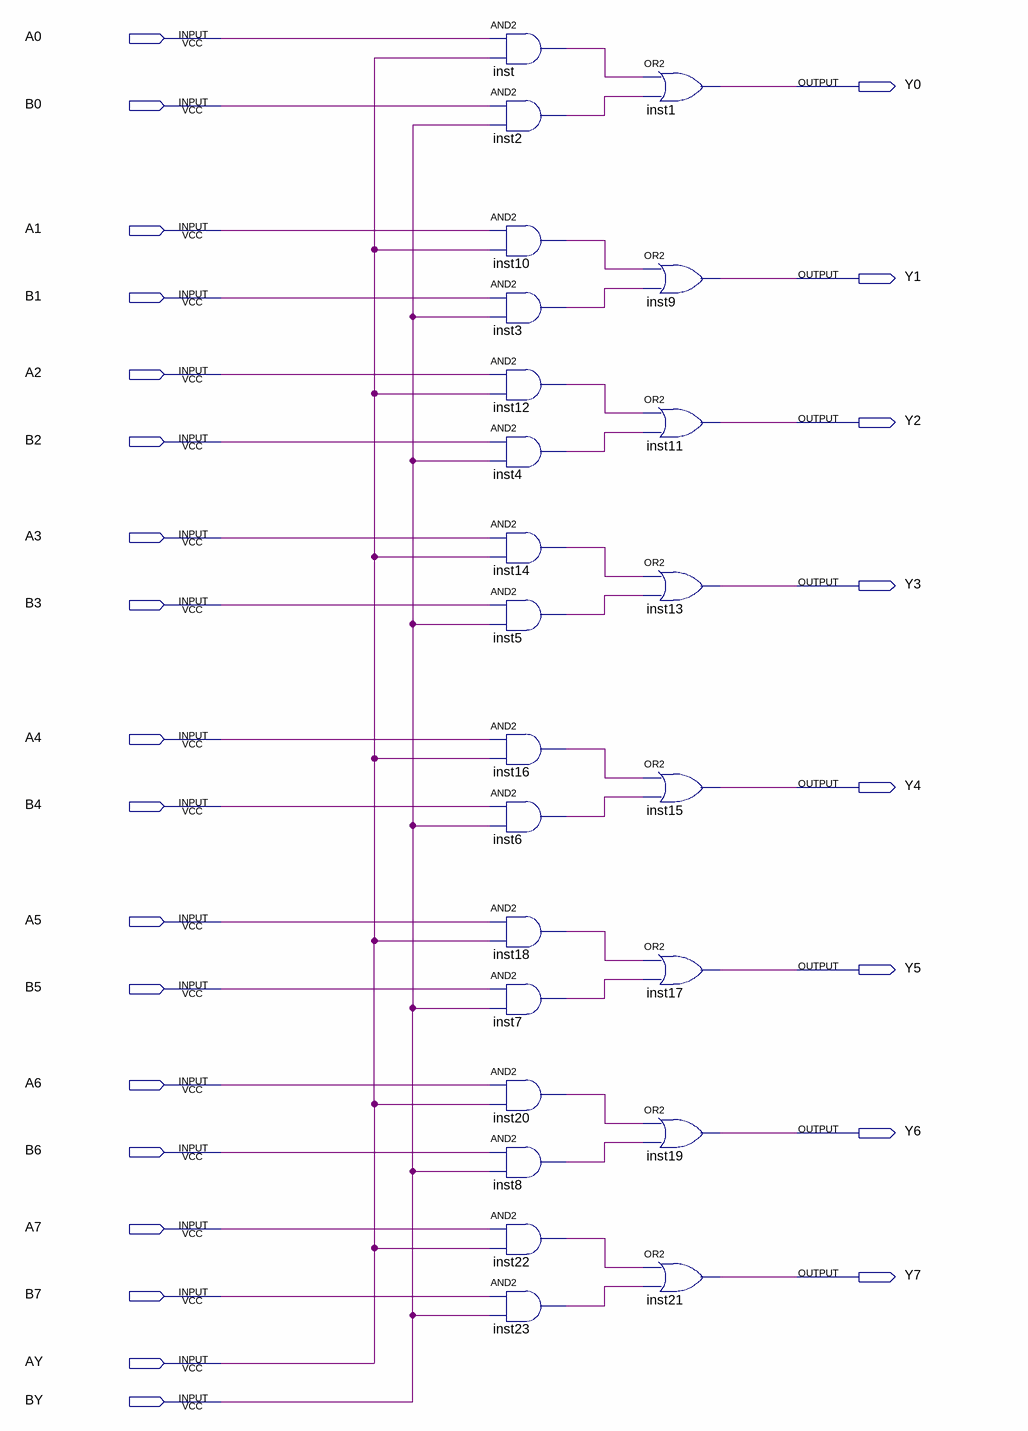
[diagram p0: schematic sheet]
// Quartus schematic multiplexer8_2.bdf as structural Verilog: 24 symbols, 26 pins
module multiplexer8_2 (
  input  A0,
  input  B0,
  input  A1,
  input  B1,
  input  A2,
  input  B2,
  input  A3,
  input  B3,
  input  A4,
  input  B4,
  input  A5,
  input  B5,
  input  A6,
  input  B6,
  input  A7,
  input  B7,
  input  AY,
  input  BY,
  output Y0,
  output Y1,
  output Y2,
  output Y3,
  output Y4,
  output Y5,
  output Y6,
  output Y7
);

  wire inst2_out, inst3_out, inst4_out, inst5_out, inst6_out, inst7_out, inst8_out, inst10_out, inst12_out,
       inst14_out, inst16_out, inst18_out, inst20_out, inst22_out, inst23_out, inst_out;

  and inst (inst_out, A0, AY);
  and inst2 (inst2_out, B0, BY);
  and inst10 (inst10_out, A1, AY);
  and inst3 (inst3_out, B1, BY);
  and inst12 (inst12_out, A2, AY);
  and inst4 (inst4_out, B2, BY);
  and inst14 (inst14_out, A3, AY);
  and inst5 (inst5_out, B3, BY);
  and inst16 (inst16_out, A4, AY);
  and inst6 (inst6_out, B4, BY);
  and inst18 (inst18_out, A5, AY);
  and inst7 (inst7_out, B5, BY);
  and inst20 (inst20_out, A6, AY);
  and inst8 (inst8_out, B6, BY);
  and inst22 (inst22_out, A7, AY);
  and inst23 (inst23_out, B7, BY);
  or inst1 (Y0, inst_out, inst2_out);
  or inst9 (Y1, inst10_out, inst3_out);
  or inst11 (Y2, inst12_out, inst4_out);
  or inst13 (Y3, inst14_out, inst5_out);
  or inst15 (Y4, inst16_out, inst6_out);
  or inst17 (Y5, inst18_out, inst7_out);
  or inst19 (Y6, inst20_out, inst8_out);
  or inst21 (Y7, inst22_out, inst23_out);
endmodule
